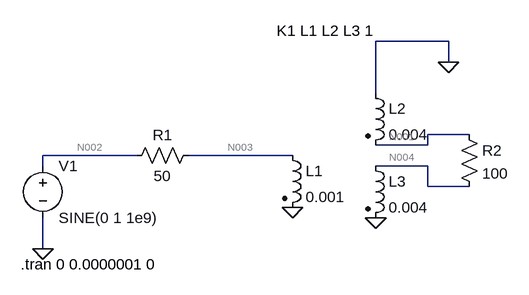
[diagram p0: schematic v2.asc]
v2.asc, the LTspice schematic file:
Version 4
SHEET 1 880 680
WIRE 608 -32 496 -32
WIRE 608 0 608 -32
WIRE 496 48 496 -32
WIRE 640 112 576 112
WIRE 576 128 576 112
WIRE 576 128 496 128
WIRE 128 144 -16 144
WIRE 368 144 208 144
WIRE -16 160 -16 144
WIRE 576 160 496 160
WIRE 576 192 576 160
WIRE 640 192 576 192
WIRE -16 288 -16 240
FLAG -16 288 0
FLAG 368 224 0
FLAG 496 240 0
FLAG 608 0 0
SYMBOL voltage -16 144 R0
WINDOW 123 0 0 Left 0
WINDOW 39 0 0 Left 0
SYMATTR InstName V1
SYMATTR Value SINE(0 1 1e9)
SYMBOL res 224 128 R90
WINDOW 0 0 56 VBottom 2
WINDOW 3 32 56 VTop 2
SYMATTR InstName R1
SYMATTR Value 50
SYMBOL res 624 96 R0
SYMATTR InstName R2
SYMATTR Value 100
SYMBOL ind2 352 128 R0
SYMATTR InstName L1
SYMATTR Value 0.001
SYMATTR Type ind
SYMBOL ind2 480 32 R0
SYMATTR InstName L2
SYMATTR Value 0.004
SYMATTR Type ind
SYMBOL ind2 480 144 R0
SYMATTR InstName L3
SYMATTR Value 0.004
SYMATTR Type ind
TEXT -50 312 Left 2 !.tran 0 0.0000001 0
TEXT 344 -48 Left 2 !K1 L1 L2 L3 1

The netlist it stands for:
* v2.asc
V1 N002 0 SINE(0 1 1e9)
R1 N003 N002 50
R2 N001 N004 100
L1 N003 0 0.001
L2 0 N001 0.004
L3 N004 0 0.004
.tran 0 0.0000001 0
K1 L1 L2 L3 1
.backanno
.end

* Results of the author's LTspice run, read from the files saved beside the schematic
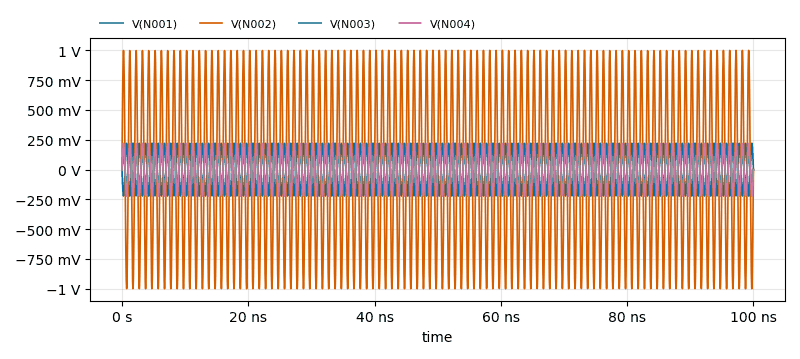
[diagram p1: Transient Analysis of v2.asc, plotted from the saved traces]
* Transient Analysis, 1 run:
*   V(N001): min -221.7 mV, max 221.7 mV, average 643.6 µV, rms 156.1 mV, last 37.05 µV
*   V(N002): min -1 V, max 1 V, average -801.6 µV, rms 713.6 mV, last 0 V
*   V(N003): min -110.8 mV, max 110.8 mV, average -320.4 µV, rms 78.06 mV, last 148.6 µV
*   V(N004): min -221.7 mV, max 221.7 mV, average -643.6 µV, rms 156.1 mV, last -37.03 µV